# Altium schematic sheet MCU.SchDoc
size Tabloid; CompanyName: Ploopy Corporation; Organization: Ploopy Corporation; Address1: Suite 226, 137-1140 Burnhamthorpe Road W; Address2: Mississauga; Address3: Ontario; Address4: Canada L5C 0A3; DocumentNumber: 4; Revision: R1.007; SheetNumber: 4; SheetTotal: 11
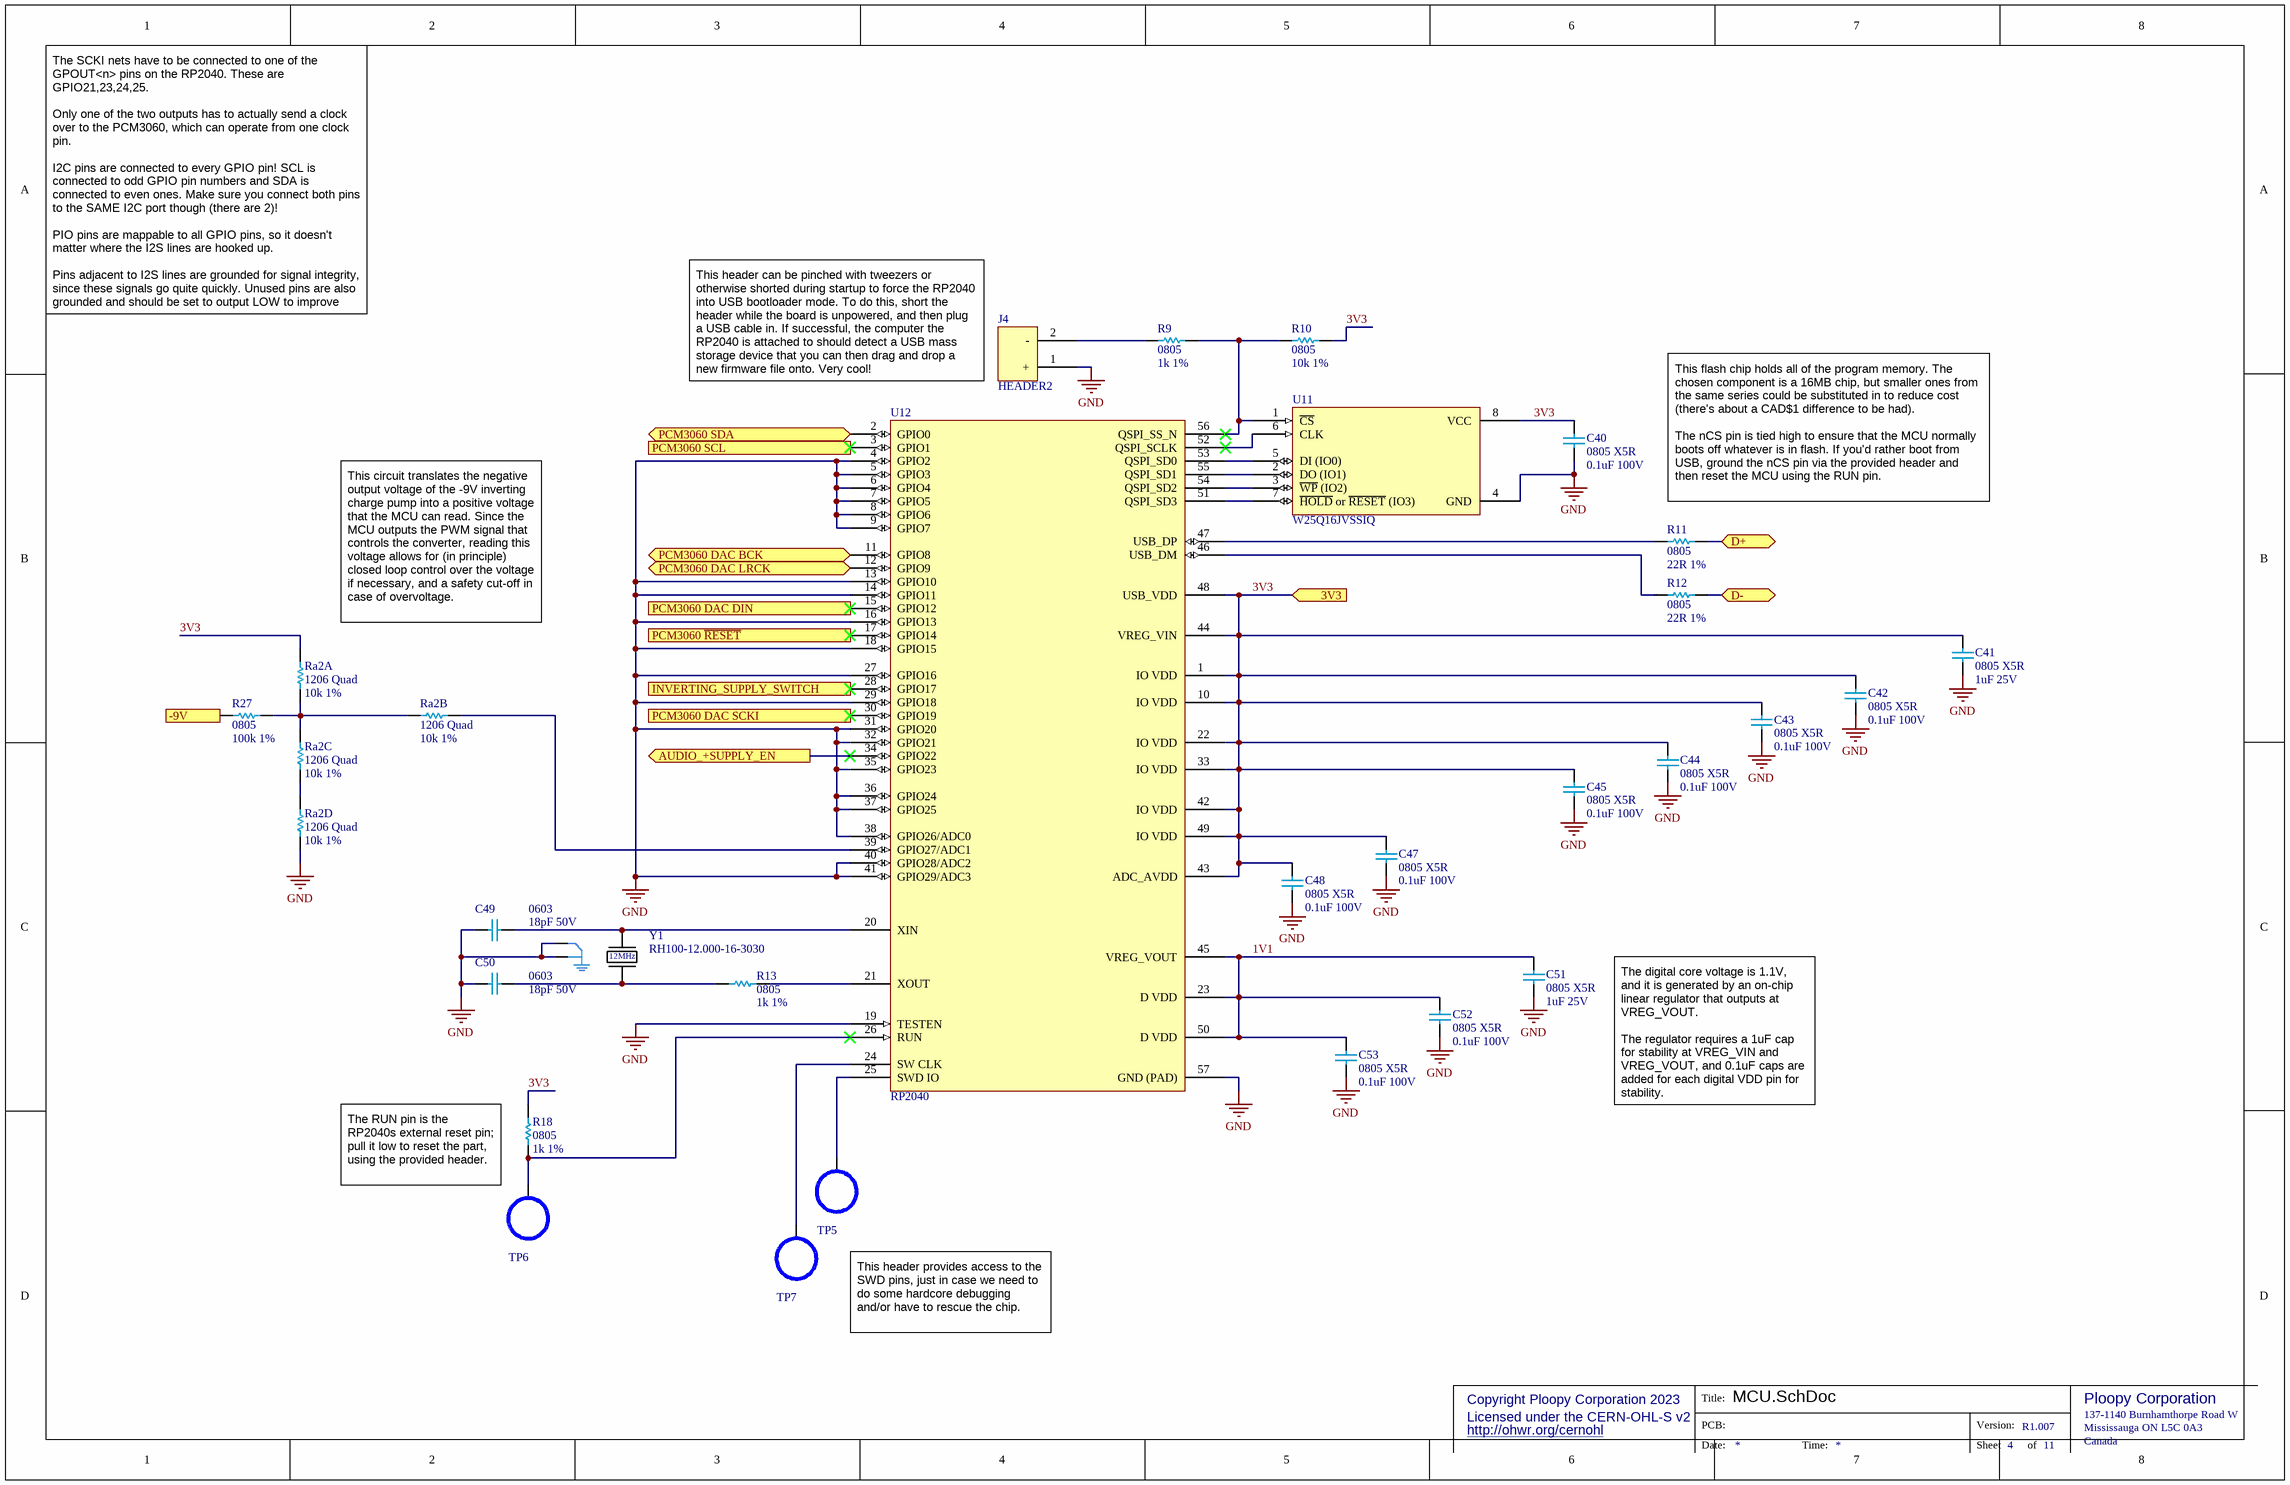
[diagram p0: MCU.SchDoc]

## Parts
C40  0805 X5R  value 0.1uF 100V  [0805 - TALL]
C41  0805 X5R  value 1uF 25V  [0805 - TALL]
C42  0805 X5R  value 0.1uF 100V  [0805 - TALL]
C43  0805 X5R  value 0.1uF 100V  [0805 - TALL]
C44  0805 X5R  value 0.1uF 100V  [0805 - TALL]
C45  0805 X5R  value 0.1uF 100V  [0805 - TALL]
C47  0805 X5R  value 0.1uF 100V  [0805 - TALL]
C48  0805 X5R  value 0.1uF 100V  [0805 - TALL]
C49  0603  value 18pF 50V  [0603]
C50  0603  value 18pF 50V  [0603]
C51  0805 X5R  value 1uF 25V  [0805 - TALL]
C52  0805 X5R  value 0.1uF 100V  [0805 - TALL]
C53  0805 X5R  value 0.1uF 100V  [0805 - TALL]
J4  HEADER2  [2x1]
R9  0805  value 1k 1%  [0805]
R10  0805  value 10k 1%  [0805]
R11  0805  value 22R 1%  [0805]
R12  0805  value 22R 1%  [0805]
R13  0805  value 1k 1%  [0805]
R18  0805  value 1k 1%  [0805]
R27  0805  value 100k 1%  [0805]
Ra2  1206 Quad  value 10k 1%  [4x 10k 1% - CAC-80P320X160-8M]  (parts A,B,C,D of 4)
TP5  TestPointHook  [S2751-46R]  (value not drawn)
TP6  TestPointHook  [S2751-46R]  (value not drawn)
TP7  TestPointHook  [S2751-46R]  (value not drawn)
U11  W25Q16JVSSIQ  [W25Q128JVS - SOIC127P790X216-8M]
U12  RP2040  [RP2040 - QFN40P700X700X90_HS-57M]
Y1  RH100-12.000-16-3030  [RH100-12.000-16-3030]

## Ports
3V3 (in), -9V (in), AUDIO_+SUPPLY_EN (out), D+ (bidir), D- (bidir), INVERTING_SUPPLY_SWITCH (out), PCM3060 DAC BCK (bidir), PCM3060 DAC DIN (out), PCM3060 DAC LRCK (bidir), PCM3060 DAC SCKI (out), PCM3060 SCL (out), PCM3060 SDA (bidir), PCM3060 ~{RESET} (out)

## Nets
GND: C40.1 C41.1 C42.1 C43.1 C44.1 C45.1 C47.1 C48.1 C49.2 C50.1 C51.1 C52.1 C53.1 J4.1(+) Ra2.5 U11.4(GND) U12.4(GPIO2) U12.5(GPIO3) U12.6(GPIO4) U12.7(GPIO5) U12.8(GPIO6) U12.9(GPIO7) U12.13(GPIO10) U12.14(GPIO11) U12.16(GPIO13) U12.18(GPIO15) U12.19(TESTEN) U12.27(GPIO16) U12.29(GPIO18) U12.31(GPIO20) U12.32(GPIO21) U12.35(GPIO23) U12.36(GPIO24) U12.37(GPIO25) U12.38(GPIO26/ADC0) U12.40(GPIO28/ADC2) U12.41(GPIO29/ADC3) U12.57(GND_(PAD)) Y1.2 Y1.4
1V1: C51.2 C52.2 C53.2 U12.23(D_VDD) U12.45(VREG_VOUT) U12.50(D_VDD)
3V3: C40.2 C41.2 C42.2 C43.2 C44.2 C45.2 C47.2 C48.2 R10.1 R18.1 Ra2.1 U11.8(VCC) U12.1(IO_VDD) U12.10(IO_VDD) U12.22(IO_VDD) U12.33(IO_VDD) U12.42(IO_VDD) U12.43(ADC_AVDD) U12.44(VREG_VIN) U12.48(USB_VDD) U12.49(IO_VDD) ; port 3V3
-9V: R27.1 ; port -9V
AUDIO_+SUPPLY_EN: U12.34(GPIO22) ; port AUDIO_+SUPPLY_EN
D+: R11.2 ; port D+
D-: R12.2 ; port D-
INVERTING_SUPPLY_SWITCH: U12.28(GPIO17) ; port INVERTING_SUPPLY_SWITCH
PCM3060 DAC BCK: U12.11(GPIO8) ; port PCM3060 DAC BCK
PCM3060 DAC DIN: U12.15(GPIO12) ; port PCM3060 DAC DIN
PCM3060 DAC LRCK: U12.12(GPIO9) ; port PCM3060 DAC LRCK
PCM3060 DAC SCKI: U12.30(GPIO19) ; port PCM3060 DAC SCKI
PCM3060 ~{RESET}: U12.17(GPIO14) ; port PCM3060 ~{RESET}
PCM3060 SCL: U12.3(GPIO1) ; port PCM3060 SCL
PCM3060 SDA: U12.2(GPIO0) ; port PCM3060 SDA
NetC49_1: C49.1 U12.20(XIN) Y1.1
NetC50_2: C50.2 R13.2 Y1.3
NetJ4_2: J4.2(-) R9.1
NetR9_2: R9.2 R10.2 U11.1(~{CS}) U12.56(QSPI_SS_N)
NetR11_1: R11.1 U12.47(USB_DP)
NetR12_1: R12.1 U12.46(USB_DM)
NetR13_1: R13.1 U12.21(XOUT)
NetR18_2: R18.2 TP6.1 U12.26(RUN)
NetR27_2: R27.2 Ra2.6 Ra2.7 Ra2.8
NetRa2_2: Ra2.2 U12.39(GPIO27/ADC1)
NetRa2_3: Ra2.3 Ra2.4
NetTP5_1: TP5.1 U12.25(SWD_IO)
NetTP7_1: TP7.1 U12.24(SW_CLK)
NetU11_2: U11.2(DO_(IO1)) U12.55(QSPI_SD1)
NetU11_3: U11.3(~{WP}_(IO2)) U12.54(QSPI_SD2)
NetU11_5: U11.5(DI_(IO0)) U12.53(QSPI_SD0)
NetU11_6: U11.6(CLK) U12.52(QSPI_SCLK)
NetU11_7: U11.7(~{HOLD}_or_~{RESET}_(IO3)) U12.51(QSPI_SD3)

## Notes on the sheet
- The SCKI nets have to be connected to one of the GPOUT<n> pins on the RP2040. These are GPIO21,23,24,25.
  Only one of the two outputs has to actually send a clock over to the PCM3060, which can operate from one clock pin.
  I2C pins are connected to every GPIO pin! SCL is connected to odd GPIO pin numbers and SDA is connected to even ones. Make sure you connect both pins to the SAME I2C port though (there are 2)!
  PIO pins are mappable to all GPIO pins, so it doesn't matter where the I2S lines are hooked up.
  Pins adjacent to I2S lines are grounded for signal integrity, since these signals go quite quickly. Unused pins are also grounded and should be set to output LOW to improve grounding.
- This header can be pinched with tweezers or otherwise shorted during startup to force the RP2040 into USB bootloader mode. To do this, short the header while the board is unpowered, and then plug a USB cable in. If successful, the computer the RP2040 is attached to should detect a USB mass storage device that you can then drag and drop a new firmware file onto. Very cool!
- (near R11) This flash chip holds all of the program memory. The chosen component is a 16MB chip, but smaller ones from the same series could be substituted in to reduce cost (there's about a CAD$1 difference to be had).
  The nCS pin is tied high to ensure that the MCU normally boots off whatever is in flash. If you'd rather boot from USB, ground the nCS pin via the provided header and then reset the MCU using the RUN pin.
- This circuit translates the negative output voltage of the -9V inverting charge pump into a positive voltage that the MCU can read. Since the MCU outputs the PWM signal that controls the converter, reading this voltage allows for (in principle) closed loop control over the voltage if necessary, and a safety cut-off in case of overvoltage.
- The digital core voltage is 1.1V, and it is generated by an on-chip linear regulator that outputs at VREG_VOUT.
  The regulator requires a 1uF cap for stability at VREG_VIN and VREG_VOUT, and 0.1uF caps are added for each digital VDD pin for stability.
- The RUN pin is the RP2040s external reset pin; pull it low to reset the part, using the provided header.
- This header provides access to the SWD pins, just in case we need to do some hardcore debugging and/or have to rescue the chip.
- Copyright Ploopy Corporation 2023
- Licensed under the CERN-OHL-S v2
- http://ohwr.org/cernohl
- Title:
- PCB:
- Version:
- Ploopy Corporation
- Mississauga ON L5C 0A3
- 137-1140 Burnhamthorpe Road W
- Date:
- Time:
- Sheet
- of
- Canada
- (in symbol RH100-12.000-16-3030) 12MHz

## Library data of the parts
C40 C42-C45 C47 C48 C52 C53 = Cap 0.1uF 100V: 0805, X5R or better; Supplier 1: Digi-Key; Supplier Part Number 1: 1276-6840-2-ND
C41 C51 = Cap 1uF 25V: 0805, X5R or better; Supplier 1: Digi-Key; Supplier Part Number 1: 1276-1066-2-ND; Supplier 2: Digi-Key; Supplier Part Number 2: 1276-1066-1-ND
C49 C50 = Cap 18pF 50V: 0603, C0G or better; Supplier 1: Digi-Key; Supplier Part Number 1: 1292-1494-1-ND
J4 = HEADER2: 2-pin 0.100" header; Supplier 1: Mouser; Supplier Part Number 1: 855-M20-9990245; Supplier 2: Digi-Key; Supplier Part Number 2: 952-2261-ND
R9 R13 R18 = Res 1k 1% 0805: Chip resistor, 1/8W 100PPM; Supplier 1: Digi-Key; Supplier Part Number 1: RMCF0805FT1K00TR-ND
R10 = Res 10k 1% 0805: Chip resistor; Supplier 1: Digi-Key; Supplier Part Number 1: RMCF0805FT10K0TR-ND
R11 R12 = Res 22R 1% 0805: Chip resistor; Supplier 1: Digi-Key; Supplier 2: Arrow; Supplier Part Number 1: RMCF0805FT22R0CT-ND; Supplier Part Number 2: RMCF0805FT22R0
R27 = Res 100k 1% 0805: Chip resistor; Supplier 1: Digi-Key; Supplier 2: Digi-Key; Supplier Part Number 1: RMCF0805FT100KTR-ND; Supplier Part Number 2: RMCF0805FT100KCT-ND
Ra2 = Quad Res 10k 1% 1206: Chip resistor
TP5-TP7 = TestPointHook: Test point, SMT ring (micro-hook compatible); Supplier 1: Digi-Key; Supplier Part Number 1: 952-2664-6-ND; Supplier 2: Digi-Key; Supplier Part Number 2: A106144DKR-ND; Supplier 3: Arrow; Supplier Part Number 3: z_4zPAhGJpPHHYBcC24zmONEz5elv0VZALWfNkICq0w
Y1 = RH100-12.000-16-3030: 12MHz Crystal 16pF 100 Ohms 4-SMD, No Lead (3.2mm x 2.5mm); Supplier 1: Digi-Key; Supplier 2: Mouser; Supplier Part Number 1: XC2686CT-ND; Supplier Part Number 2: 520-160-12-30B-AGMT
U11 = W25Q16JVSSIQ: Supplier 1: Digi-Key; Supplier Part Number 1: W25Q16JVSSIQ-ND
U12 = RP2040: Supplier 1: Newark; Supplier Part Number 1: 49AJ8740